# Altium schematic sheet Kasli-SOC_bank13.SchDoc: Bank 13
size 420 x 297 mm; Projet: FPGA & ARM SoC FMC Carrier; CheckedBy: G.Kasprowicz; Author: F.Switakowski; CompanyName: WUT ISE; DrawnBy: F.Switakowski; Organization: WUT ISE; Address1: PW ISE; Address2: Nowowiejska 15/19 00-665 Warsaw; Address3: gkasprow@gmail.com; DocumentNumber: 8; Revision: 1; SheetNumber: 8; SheetTotal: 18; ModifiedBy: -; CheckedDate: -; Title2: misc signals; DivGrp: WUT ISE; Designer: G.Kasprowicz; ModifiedDate: -; ProjectName: Sensor Box
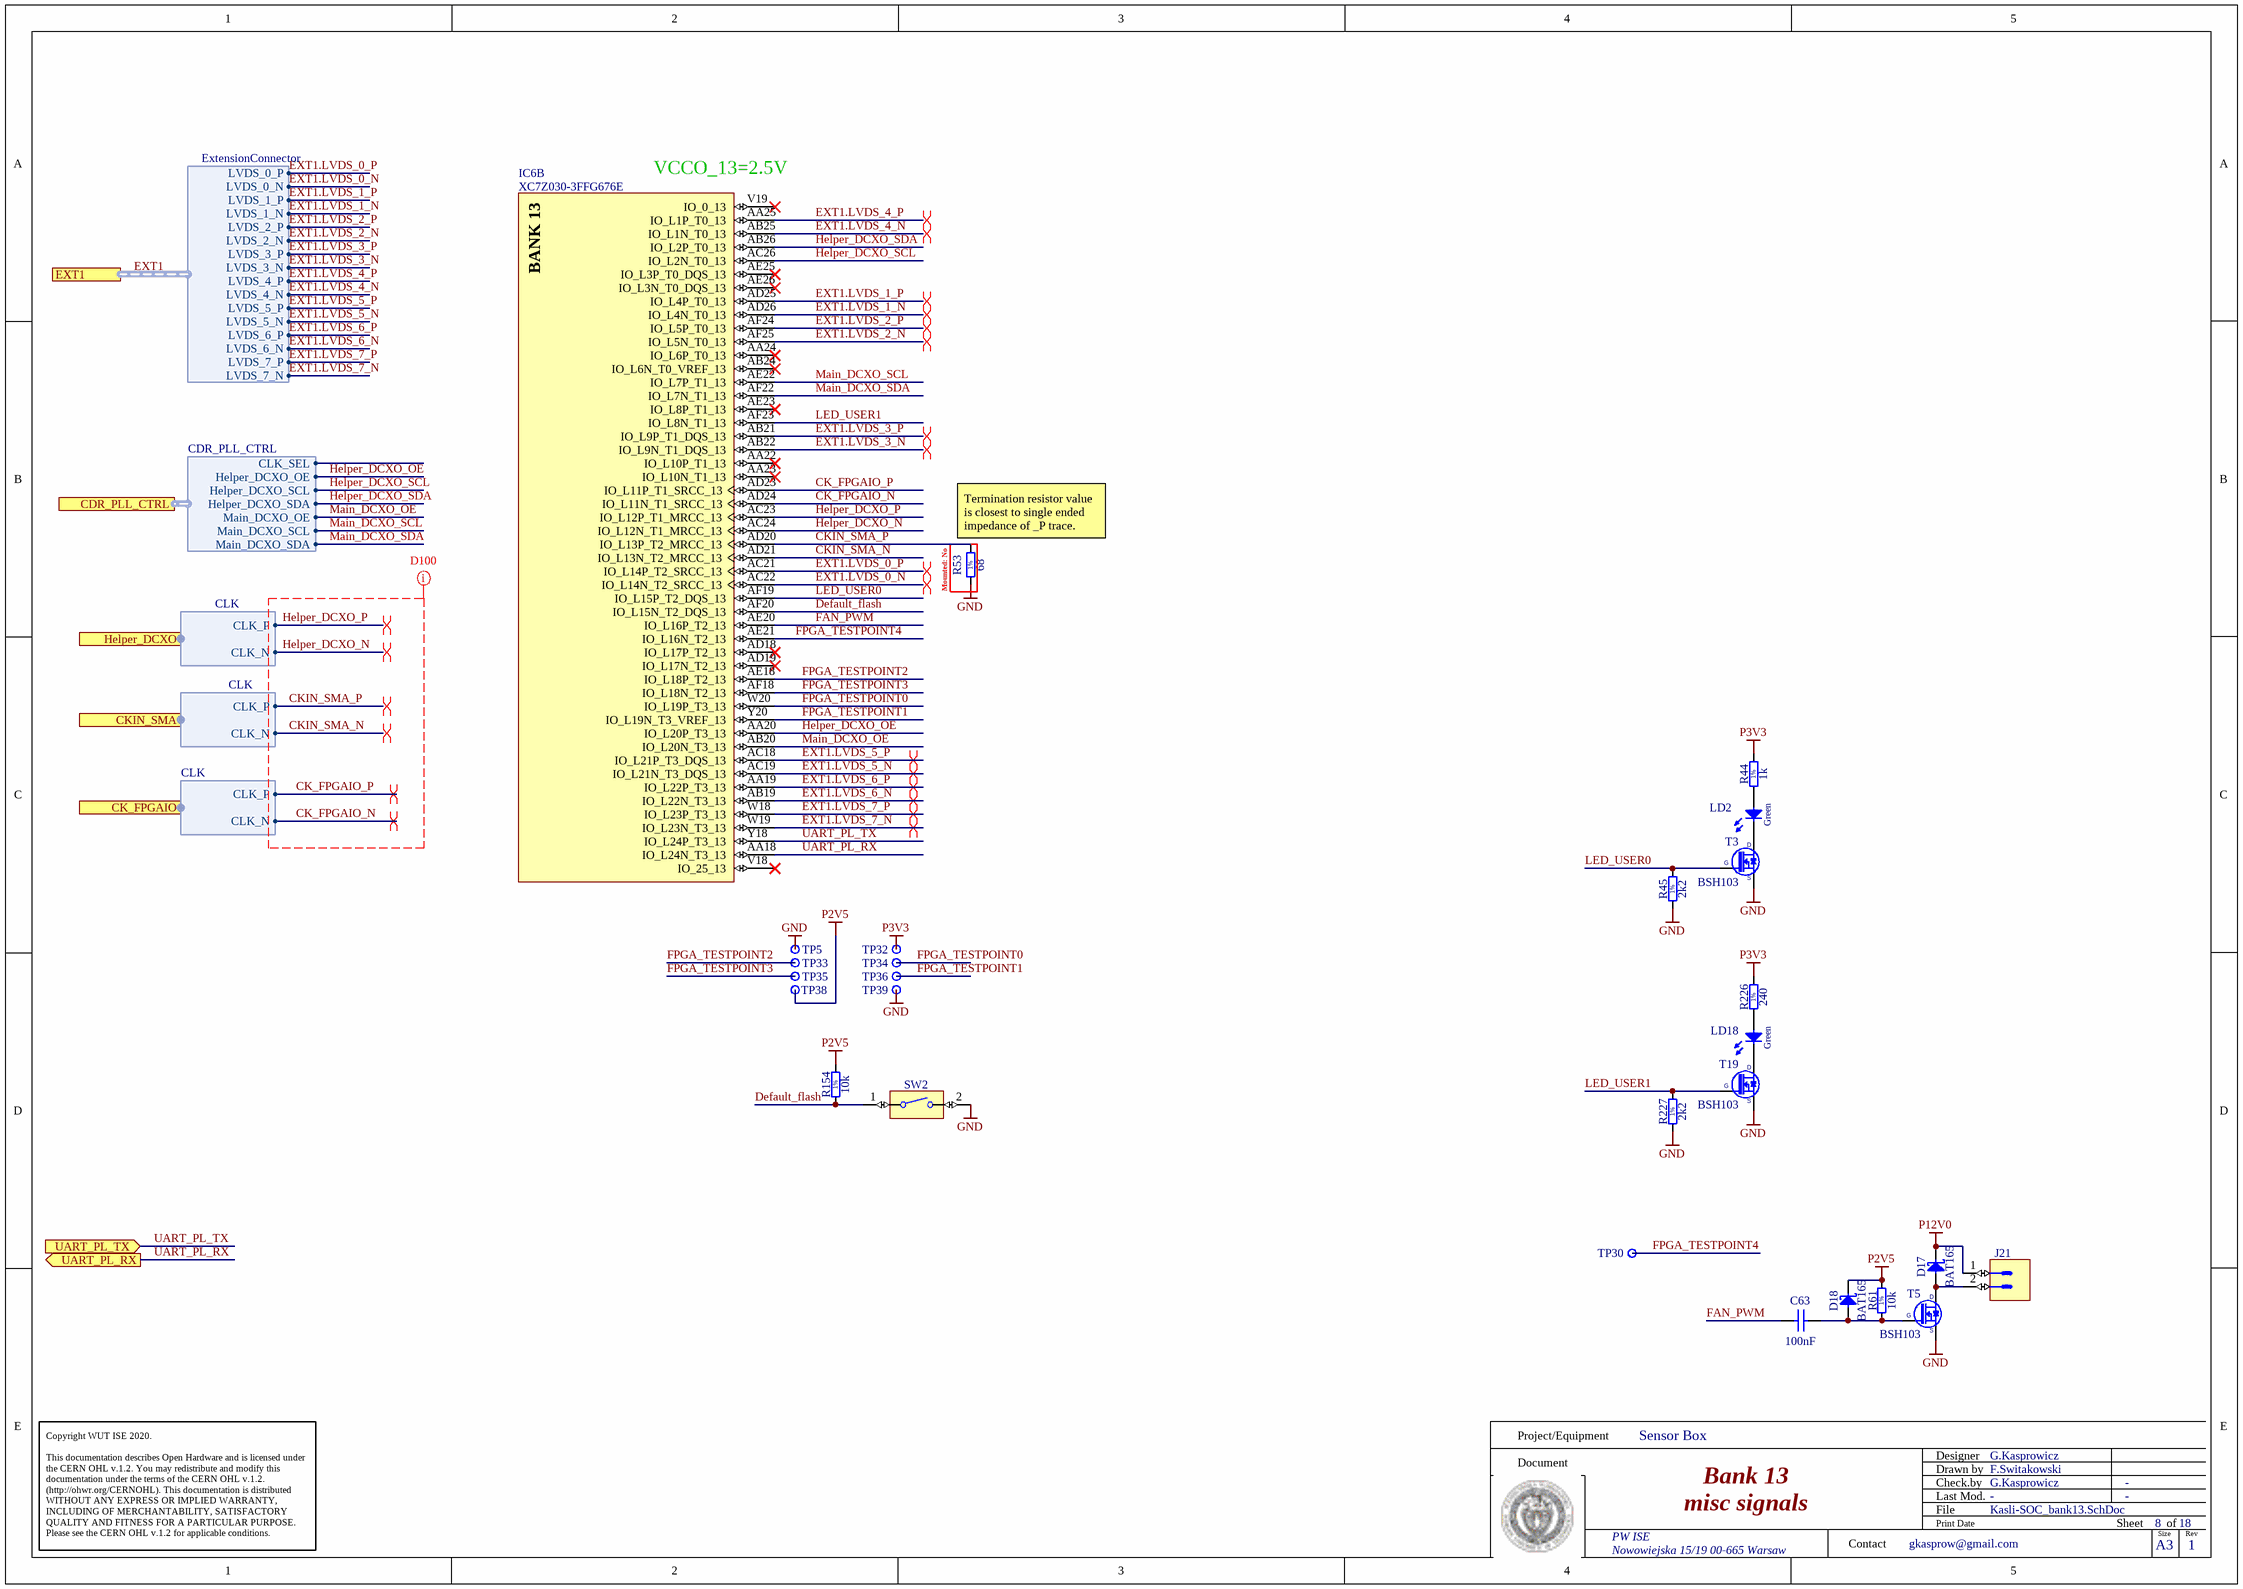
[diagram p0: Kasli-SOC_bank13.SchDoc]

## Parts
C63  100nF  [CAPC0603X33N]
D17  BAT165  [SOD2512X110N]
D18  BAT165  [SOD2512X110N]
IC6  XC7Z030-3FFG676E  [BGA676C100P26X26_2700X2700X324]  (part B of 14)
J21  KK®  [MOLEX_22-27-2021]  (value not drawn)
LD2  Green  [LED_KINGBRIGHT_KPH-1608CGCK]
LD18  Green  [LED_AVAGO_HSME-C120]
R44  1k  [RESC1005X40N]
R45  2k2  [RESC1005X40N]
R53  68  [RESC1005X40N]
R61  10k  [RESC1005X40N]
R154  10k  [RESC1005X40N]
R226  240  [RESC1005X40N]
R227  2k2  [RESC1005X40N]
SW2  Switch  [SW_OMRON_B3U-3000PM]  (value not drawn)
T3  BSH103  [SOT95P230X110-3N]
T5  BSH103  [SOT95P230X110-3N]
T19  BSH103  [SOT95P230X110-3N]
TP5  Plated Hole  [c170h100]  (value not drawn)  (no BOM)
TP30  Test Point  [TPS127]  (value not drawn)  (no BOM)
TP32  Plated Hole  [c170h100]  (value not drawn)  (no BOM)
TP33  Plated Hole  [c170h100]  (value not drawn)  (no BOM)
TP34  Plated Hole  [c170h100]  (value not drawn)  (no BOM)
TP35  Plated Hole  [c170h100]  (value not drawn)  (no BOM)
TP36  Plated Hole  [c170h100]  (value not drawn)  (no BOM)
TP38  Plated Hole  [c170h100]  (value not drawn)  (no BOM)
TP39  Plated Hole  [c170h100]  (value not drawn)  (no BOM)

## Ports
CDR_PLL_CTRL (harness CDR_PLL_CTRL), CK_FPGAIO (harness CLK), CKIN_SMA (harness CLK), EXT1 (harness ExtensionConnector), Helper_DCXO (harness CLK), UART_PL_RX (out), UART_PL_TX (in)

## Harnesses
CDR_PLL_CTRL: CLK_SEL, Helper_DCXO_OE, Helper_DCXO_SCL, Helper_DCXO_SDA, Main_DCXO_OE, Main_DCXO_SCL, Main_DCXO_SDA
ExtensionConnector: LVDS_0_N, LVDS_0_P, LVDS_1_N, LVDS_1_P, LVDS_2_N, LVDS_2_P, LVDS_3_N, LVDS_3_P, LVDS_4_N, LVDS_4_P, LVDS_5_N, LVDS_5_P, LVDS_6_N, LVDS_6_P, LVDS_7_N, LVDS_7_P
CLK: CLK_P, CLK_N

## Nets
GND: R45.1 R53.1 R227.1 SW2.2 T3.2(S) T5.2(S) T19.2(S) TP5.1 TP39.1
P2V5: D18.1(C) R61.2 R154.2 TP38.1
P3V3: R44.2 R226.2 TP32.1
P12V0: D17.1(C) J21.1
CK_FPGAIO_N: IC6.AD24(IO_L11N_T1_SRCC_13) ; port CK_FPGAIO.CLK_N
CK_FPGAIO_P: IC6.AD23(IO_L11P_T1_SRCC_13) ; port CK_FPGAIO.CLK_P
CKIN_SMA_N: IC6.AD21(IO_L13N_T2_MRCC_13) ; port CKIN_SMA.CLK_N
CKIN_SMA_P: IC6.AD20(IO_L13P_T2_MRCC_13) R53.2 ; port CKIN_SMA.CLK_P
Default_flash: IC6.AF20(IO_L15N_T2_DQS_13) R154.1 SW2.1
EXT1.LVDS_0_N: IC6.AC22(IO_L14N_T2_SRCC_13) ; port EXT1.LVDS_0_N
EXT1.LVDS_0_P: IC6.AC21(IO_L14P_T2_SRCC_13) ; port EXT1.LVDS_0_P
EXT1.LVDS_1_N: IC6.AD26(IO_L4N_T0_13) ; port EXT1.LVDS_1_N
EXT1.LVDS_1_P: IC6.AD25(IO_L4P_T0_13) ; port EXT1.LVDS_1_P
EXT1.LVDS_2_N: IC6.AF25(IO_L5N_T0_13) ; port EXT1.LVDS_2_N
EXT1.LVDS_2_P: IC6.AF24(IO_L5P_T0_13) ; port EXT1.LVDS_2_P
EXT1.LVDS_3_N: IC6.AB22(IO_L9N_T1_DQS_13) ; port EXT1.LVDS_3_N
EXT1.LVDS_3_P: IC6.AB21(IO_L9P_T1_DQS_13) ; port EXT1.LVDS_3_P
EXT1.LVDS_4_N: IC6.AB25(IO_L1N_T0_13) ; port EXT1.LVDS_4_N
EXT1.LVDS_4_P: IC6.AA25(IO_L1P_T0_13) ; port EXT1.LVDS_4_P
EXT1.LVDS_5_N: IC6.AC19(IO_L21N_T3_DQS_13) ; port EXT1.LVDS_5_N
EXT1.LVDS_5_P: IC6.AC18(IO_L21P_T3_DQS_13) ; port EXT1.LVDS_5_P
EXT1.LVDS_6_N: IC6.AB19(IO_L22N_T3_13) ; port EXT1.LVDS_6_N
EXT1.LVDS_6_P: IC6.AA19(IO_L22P_T3_13) ; port EXT1.LVDS_6_P
EXT1.LVDS_7_N: IC6.W19(IO_L23N_T3_13) ; port EXT1.LVDS_7_N
EXT1.LVDS_7_P: IC6.W18(IO_L23P_T3_13) ; port EXT1.LVDS_7_P
FAN_PWM: C63.2 IC6.AE20(IO_L16P_T2_13)
FPGA_TESTPOINT0: IC6.W20(IO_L19P_T3_13) TP34.1
FPGA_TESTPOINT1: IC6.Y20(IO_L19N_T3_VREF_13) TP36.1
FPGA_TESTPOINT2: IC6.AE18(IO_L18P_T2_13) TP33.1
FPGA_TESTPOINT3: IC6.AF18(IO_L18N_T2_13) TP35.1
FPGA_TESTPOINT4: IC6.AE21(IO_L16N_T2_13) TP30.1
Helper_DCXO_N: IC6.AC24(IO_L12N_T1_MRCC_13) ; port Helper_DCXO.CLK_N
Helper_DCXO_OE: IC6.AA20(IO_L20P_T3_13) ; port CDR_PLL_CTRL.Helper_DCXO_OE
Helper_DCXO_P: IC6.AC23(IO_L12P_T1_MRCC_13) ; port Helper_DCXO.CLK_P
Helper_DCXO_SCL: IC6.AC26(IO_L2N_T0_13) ; port CDR_PLL_CTRL.Helper_DCXO_SCL
Helper_DCXO_SDA: IC6.AB26(IO_L2P_T0_13) ; port CDR_PLL_CTRL.Helper_DCXO_SDA
LED_USER0: IC6.AF19(IO_L15P_T2_DQS_13) R45.2 T3.1(G)
LED_USER1: IC6.AF23(IO_L8N_T1_13) R227.2 T19.1(G)
Main_DCXO_OE: IC6.AB20(IO_L20N_T3_13) ; port CDR_PLL_CTRL.Main_DCXO_OE
Main_DCXO_SCL: IC6.AE22(IO_L7P_T1_13) ; port CDR_PLL_CTRL.Main_DCXO_SCL
Main_DCXO_SDA: IC6.AF22(IO_L7N_T1_13) ; port CDR_PLL_CTRL.Main_DCXO_SDA
UART_PL_RX: IC6.AA18(IO_L24N_T3_13) ; port UART_PL_RX
UART_PL_TX: IC6.Y18(IO_L24P_T3_13) ; port UART_PL_TX
NetC63_1: C63.1 D18.2(A) R61.1 T5.1(G)
NetD17_2: D17.2(A) J21.2 T5.3(D)
NetLD2_1: LD2.1(C) T3.3(D)
NetLD2_2: LD2.2(A) R44.1
NetLD18_1: LD18.1(C) T19.3(D)
NetLD18_2: LD18.2(A) R226.1

Not connected (* = marked no-connect by the designer): IC6 AA22(IO_L10P_T1_13)* AA23(IO_L10N_T1_13)* AA24(IO_L6P_T0_13)* AB24(IO_L6N_T0_VREF_13)* AD18(IO_L17P_T2_13)* AD19(IO_L17N_T2_13)* AE23(IO_L8P_T1_13)* AE25(IO_L3P_T0_DQS_13)* AE26(IO_L3N_T0_DQS_13)* V18(IO_25_13)* V19(IO_0_13)*

## Buses and harness runs
harness EXT1 = port EXT1

## Layout directives
differential pair; differential pair class LVPECL: CK_FPGAIO_N, CK_FPGAIO_P
differential pair; differential pair class Diff_100Ohm: CKIN_SMA_N, CKIN_SMA_P, Helper_DCXO_N, Helper_DCXO_P
differential pair: EXT1.LVDS_0_N, EXT1.LVDS_0_P, EXT1.LVDS_1_N, EXT1.LVDS_1_P, EXT1.LVDS_2_N, EXT1.LVDS_2_P, EXT1.LVDS_3_N, EXT1.LVDS_3_P, EXT1.LVDS_4_N, EXT1.LVDS_4_P, EXT1.LVDS_5_N, EXT1.LVDS_5_P, EXT1.LVDS_6_N, EXT1.LVDS_6_P, EXT1.LVDS_7_N, EXT1.LVDS_7_P
net class D100: CK_FPGAIO_N, CK_FPGAIO_P, CKIN_SMA_N, CKIN_SMA_P, Helper_DCXO_N, Helper_DCXO_P

## Notes on the sheet
- (near IC6) VCCO_13=2.5V
- (near R53) Termination resistor value is closest to single ended impedance of _P trace.
- (near R53) Mounted: No
- Project/Equipment
- Document
- Designer
- Drawn by
- Check.by
- Copyright WUT ISE 2020.
  This documentation describes Open Hardware and is licensed under the CERN OHL v.1.2. You may redistribute and modify this documentation under the terms of the CERN OHL v.1.2. (http://ohwr.org/CERNOHL). This documentation is distributed WITHOUT ANY EXPRESS OR IMPLIED WARRANTY, INCLUDING OF MERCHANTABILITY, SATISFACTORY QUALITY AND FITNESS FOR A PARTICULAR PURPOSE. Please see the CERN OHL v.1.2 for applicable conditions.
- Contact
- File
- Last Mod.
- Print Date
- Sheet
- Size
- A3
- of
- Rev
- (in symbol R0402_1k_1%_0.0625W_100PPM) 1%
- (in symbol R0402_2K2_1%_0.0625W_100PPM) 1%
- (in symbol R0402_10k_1%_0.0625W_100PPM) 1%
- (in symbol R0402_68R_1%_0.0625W_100PPM) 1%
- (in symbol R0402_240R_1%_0.0625W_100PPM) 1%
- (in symbol XC7Z030-2FFG676I, part B) BANK 13

## Library data of the parts
C63 = CC0201_100NF_6.3V_10%_X5R: Non-polarised capacitor; Part Description: SMD Multilayer Chip Ceramic Capacitor; Manufacturer: GENERIC; Manufacturer1 Part Number: 02016D104KAT2A; Voltage: 6.3V; TC: X5R; Tolerance: ±10%; Part Number: CC0201_100NF_6.3V_10%_X5R; Component Kind: Standard; Component Type: Standard; Pin Count: 2; Value: 100nF; Status: Not Recommended; Manufacturer Part Number: CC0201_100NF_6.3V_10%_X5R; Case: 0201; Mounted: Yes; Socket: No; SMD: Yes; Sense: No; Manufacturer1 Example: AVX; Manufacturer1 ComponentHeight: 0.33mm; HelpURL: \\cern.ch\dfs\Applications\Altium\Datasheets\CC0201_X5R_AVX.pdf; Author: CERN DEM JLC; CreateDate: 2007-12-03; LatestRevisionDate: 2007-12-03; ClassName: FPGA_JTAG
D17 D18 = BAT165: Schottky Diode; Part Description: Medium Power AF Schottky Diode; Manufacturer: INFINEON; Voltage: 40V; Power: 750mA; PressFit: No; Bonding: No; Part Number: BAT165; Component Kind: Standard; Component Type: Standard; Device: BAT165; PackageDescription: Small Outline Diode (SOD-323), 1.70mm W X 1.25mm L X 1.10mm H body,  IPC Medium Density; Manufacturer Part Number: BAT165; Pin Count: 2; Case: SOD323; Mounted: Yes; Socket: No; SMD: Yes; Sense: No; ComponentHeight: 1.1mm; HelpURL: \\cern.ch\dfs\Applications\Altium\Datasheets\BAT165.pdf; Author: CERN DEM JLC; CreateDate: 12.11.2014; LatestRevisionDate: 12.11.2014
IC6 = XC7Z030-2FFG676I: 733 MHz Zynq™-7000 AP SoC, 130 PS I/O, 254 FPGA I/O, 676-Ball BGA, Speed Grade 2, Industrial Grade, Pb-Free; Part Description: Zynq™-7000 All Programmable SoC, Dual-core ARM® Cortex™-A9 CPU, 676-Ball BGA, Speed Grade 2, Industrial Grade, Pb-Free; Manufacturer: XILINX; PressFit: No; Bonding: No; Part Number: XC7Z030-3FFG676E; Component Kind: Standard; Component Type: Standard; Device: XC7Z030-2FFG676I; PackageDescription: BGA, 1.00mm Pitch, Square; 676 Pin, 26 Columns X 26 Rows, 27.00mm X 27.00mm X 2.60mm H; Manufacturer Part Number: XC7Z030-3FFG676E; Pin Count: 676; Case: BGA676; Mounted: Yes; Socket: No; SMD: Yes; Sense: No; ComponentHeight: 3.24mm; HelpURL: \\cern.ch\dfs\Applications\Altium\Datasheets\XC7Z030-2FFG676I.pdf; ComponentLink1URL: \\cern.ch\dfs\Applications\Altium\Datasheets\XC7Z030-2FFG676I_Package.pdf; ComponentLink1Description: Package; ComponentLink2URL: \\cern.ch\dfs\Applications\Altium\Datasheets\XC7Z030-2FFG676I_Pinout.txt; ComponentLink2Description: Pinout; Author: CERN DEM JLC; CreateDate: 29/04/2014; LatestRevisionDate: 29/04/2014
J21 = MOLEX_22-27-2021: Connector 2 Male; Part Description: 2.54mm (.100") Pitch KK® Wire-to-Board Header, Vertical, with Friction Lock, 2 Circuits, Tin (Sn) Plating; Manufacturer: MOLEX; PressFit: No; Part Number: MOLEX_22-27-2021; Component Kind: Standard; Component Type: Standard; Pin Count: 2; Family: KK®; Mounted: Yes; Socket: No; SMD: No; Sense: No; Status: None; Manufacturer Part Number: 22-27-2021; ComponentHeight: 11.7mm; HelpURL: \\cern.ch\dfs\Applications\Altium\Datasheets\MOLEX_22-27-2021.pdf; Author: CERN DEM JLC; CreateDate: 04.12.2008; LatestRevisionDate: 04.12.2008
LD2 = LED_KINGBRIGHT_KPH-1608CGCK: LED Green 1C 2A; Part Description: SMD Green LED, Case 1.6mmX0.8mm(0603), 0.65mm Thickness; PressFit: No; Bonding: No; Manufacturer Part Number: KPH-1608CGCK; ComponentHeight: 0.65mm; HelpURL: \\cern.ch\dfs\Applications\Altium\Datasheets\LED_KINGBRIGHT_KPH-1608CGCK.pdf; Part Number: LED_KINGBRIGHT_KPH-1608CGCK; Component Kind: Standard; Component Type: Standard; Color: Green; PackageDescription: SMT Green LED, Case 0603, Body L 1.6 x W 0.8mm H 0.65mm; Manufacturer: KINGBRIGHT; Pin Count: 2; Mounted: Yes; Socket: No; SMD: Yes; Sense: No; Author: CERN DEM JLC; CreateDate: 03.07.2017; LatestRevisionDate: 03.07.2017
LD18 = LED_AVAGO_HSME-C120: LED Green 1C 2A; Part Description: High Performance Right Angle Chip Green LED; Manufacturer: AVAGO TECHNOLOGIES; PressFit: No; Bonding: No; Manufacturer Part Number: HSME-C120; ComponentHeight: 0.7mm; HelpURL: \\cern.ch\dfs\Applications\Altium\Datasheets\LED_AVAGO_HSME-C120.pdf; Part Number: LED_AVAGO_HSME-C120; Component Kind: Standard; Component Type: Standard; Color: Green; PackageDescription: Green Chip LED, 2-Leads, Body 1.7x1.1mm, Side Emitting Package; Pin Count: 2; Mounted: Yes; Socket: No; SMD: Yes; Sense: No; Author: CERN DEM JMW; CreateDate: 22.07.2009; LatestRevisionDate: 20.06.2012; ComponentLink1URL: \\cern.ch\dfs\Applications\Altium\Datasheets\LED_AVAGO_HSME-C110_DESIGN-GUIDE.pdf; ComponentLink1Description: Design Guide
R44 = R0402_1k_1%_0.0625W_100PPM: Resistor - 1%; Part Description: General Purpose Thick Film Chip Resistor; Manufacturer: GENERIC; Manufacturer1 Part Number: 232270671002L; TC: ±100ppm/°C; PressFit: No; Part Number: R0402_1K_1%_0.0625W_100PPM; Component Kind: Standard; Component Type: Standard; Pin Count: 2; Value: 1k; Status: Not Recommended; Power: 0.0625W; Tolerance: ±1%; Manufacturer Part Number: R0402_1K_1%_0.0625W_100PPM; Case: 0402; Mounted: Yes; Sense: No; Socket: No; SMD: Yes; Manufacturer1 Example: YAGEO PHYCOMP; Manufacturer1 ComponentHeight: 0.4mm; HelpURL: \\cern.ch\dfs\Applications\Altium\Datasheets\R0402_Phycomp_RC0402.pdf; Author: CERN DEM JLC; CreateDate: 03.12.2007; LatestRevisionDate: 17.10.2012; ClassName: Artix
R45 R227 = R0402_2K2_1%_0.0625W_100PPM: Resistor - 1%; Part Description: General Purpose Thick Film Chip Resistor; Manufacturer: GENERIC; Manufacturer1 Part Number: 232270672202L; TC: ±100ppm/°C; PressFit: No; Part Number: R0402_2K2_1%_0.0625W_100PPM; Component Kind: Standard; Component Type: Standard; Pin Count: 2; Value: 2k2; Status: Not Recommended; Power: 0.0625W; Tolerance: ±1%; Manufacturer Part Number: R0402_2K2_1%_0.0625W_100PPM; Case: 0402; Mounted: Yes; Sense: No; Socket: No; SMD: Yes; Manufacturer1 Example: YAGEO PHYCOMP; Manufacturer1 ComponentHeight: 0.4mm; HelpURL: \\cern.ch\dfs\Applications\Altium\Datasheets\R0402_Phycomp_RC0402.pdf; Author: CERN DEM JLC; CreateDate: 03.12.2007; LatestRevisionDate: 17.10.2012; ClassName: Artix
R53 = R0402_68R_1%_0.0625W_100PPM: Resistor - 1%; Part Description: General Purpose Thick Film Chip Resistor; Manufacturer: GENERIC; Manufacturer1 Part Number: 232270676809L; TC: ±100ppm/°C; PressFit: No; Part Number: R0402_68R_1%_0.0625W_100PPM; Component Kind: Standard; Component Type: Standard; Pin Count: 2; Value: 68; Status: Not Recommended; Power: 0.0625W; Tolerance: ±1%; Manufacturer Part Number: R0402_68R_1%_0.0625W_100PPM; Case: 0402; Mounted: Yes; Sense: No; Socket: No; SMD: Yes; Manufacturer1 Example: YAGEO PHYCOMP; Manufacturer1 ComponentHeight: 0.4mm; HelpURL: \\cern.ch\dfs\Applications\Altium\Datasheets\R0402_Phycomp_RC0402.pdf; Author: CERN DEM JLC; CreateDate: 03.12.2007; LatestRevisionDate: 17.10.2012
R61 R154 = R0402_10k_1%_0.0625W_100PPM: Resistor - 1%; Part Description: General Purpose Thick Film Chip Resistor; Manufacturer: GENERIC; Manufacturer1 Part Number: 232270671003L; TC: ±100ppm/°C; PressFit: No; Part Number: R0402_10K_1%_0.0625W_100PPM; Component Kind: Standard; Component Type: Standard; Pin Count: 2; Value: 10k; Status: Not Recommended; Power: 0.0625W; Tolerance: ±1%; Manufacturer Part Number: R0402_10K_1%_0.0625W_100PPM; Case: 0402; Mounted: Yes; Sense: No; Socket: No; SMD: Yes; Manufacturer1 Example: YAGEO PHYCOMP; Manufacturer1 ComponentHeight: 0.4mm; HelpURL: \\cern.ch\dfs\Applications\Altium\Datasheets\R0402_Phycomp_RC0402.pdf; Author: CERN DEM JLC; CreateDate: 03.12.2007; LatestRevisionDate: 17.10.2012
R226 = R0402_240R_1%_0.0625W_100PPM: Resistor - 1%; Part Description: General Purpose Thick Film Chip Resistor; Manufacturer: GENERIC; Manufacturer1 Part Number: 232270672401L; TC: ±100ppm/°C; PressFit: No; Part Number: R0402_240R_1%_0.0625W_100PPM; Component Kind: Standard; Component Type: Standard; Pin Count: 2; Value: 240; Status: Not Recommended; Power: 0.0625W; Tolerance: ±1%; Manufacturer Part Number: R0402_240R_1%_0.0625W_100PPM; Case: 0402; Mounted: Yes; Sense: No; Socket: No; SMD: Yes; Manufacturer1 Example: YAGEO PHYCOMP; Manufacturer1 ComponentHeight: 0.4mm; HelpURL: \\cern.ch\dfs\Applications\Altium\Datasheets\R0402_Phycomp_RC0402.pdf; Author: CERN DEM JLC; CreateDate: 03.12.2007; LatestRevisionDate: 17.10.2012
SW2 = SW_OMRON_B3U-3000PM: 1 Ways SPST DIP Switch; Part Description: Ultra-small Surface-mounting Tactile Switche with High Contact Reliability, Side-actuated, Contact Rating 50mA 12VDC; Manufacturer: OMRON; PressFit: No; Sense Comment: Non-washable; Part Number: SW_OMRON_B3U-3000PM; Component Kind: Standard; Component Type: Standard; Pin Count: 2; PackageDescription: Body 3.2x4.0mm, SPST Surface-Mounting Tactile Switch with Side Actuator (B3U Series); Family: Switch; Mounted: Yes; Socket: No; SMD: Yes; Sense: Yes; Status: None; Manufacturer Part Number: B3U-3000PM; ComponentHeight: 1.35mm; HelpURL: \\cern.ch\dfs\Applications\Altium\Datasheets\SW_OMRON_B3U.pdf; Author: CERN DEM HF; CreateDate: 04.10.2022; LatestRevisionDate: 04.10.2022
T3 T5 T19 = BSH103: N-CHANNEL MOSFET WITH DIODE; Part Description: 30V 850mA N-Channel Enhancement Mode Field-Effect Transistor; Manufacturer: NEXPERIA; PressFit: No; Bonding: No; Part Number: BSH103; Component Kind: Standard; Component Type: Standard; Device: BSH103; PackageDescription: SOT23, 3 pin, Pitch 0.95mm - 1.3mm W X 2.9mm L X 1.1mm H, IPC Medium Density; Manufacturer Part Number: BSH103; Pin Count: 3; Case: SOT23-3; Mounted: Yes; Socket: No; SMD: Yes; Sense: No; ComponentHeight: 1.1mm; HelpURL: \\cern.ch\dfs\Applications\Altium\Datasheets\BSH103.pdf; Author: CERN DEM JLC; CreateDate: 16.03.2010; LatestRevisionDate: 20.06.2017; ClassName: Artix
TP5 TP32-TP36 TP38 TP39 = PLATED_HOLE1.0_PAD1.7: Single Terminal Socket; Part Description: Plated Through Hole: Hole Dia.=1.0mm Pad Dia.=1.7mm,  IPC-7251 Level A; Mounted: No; Part Number: PLATED_HOLE1.0_PAD1.7; Component Type: Standard (No BOM); Pin Count: 1; Family: Plated Hole; Socket: No; SMD: No; Sense: No; Status: None; ComponentHeight: 0mm; HelpURL: Undefined; Author: CERN DEM JLC; CreateDate: 11.05.2017; LatestRevisionDate: 11.05.2017; PackageDescription: Plated Through Hole: Hole Dia.=1.0mm Pad Dia.=1.7mm,  IPC-7251 Level A
TP30 = SMD_PAD_1.27X1.27MM: Part Description: 1.27mm x 1.27mm PCB Copper Area (SMD Test Point); Mounted: No; Part Number: SMD_PAD_1.27X1.27MM; Component Type: Standard (No BOM); Pin Count: 1; Family: Test Point; Socket: No; SMD: No; Sense: No; Status: None; ComponentHeight: 0mm; HelpURL: Undefined; Author: CERN DEM JLC; CreateDate: 12.01.2008; LatestRevisionDate: 12.01.2008; PackageDescription: 1.27mm x 1.27mm PCB Copper Area (SMD Test Point)